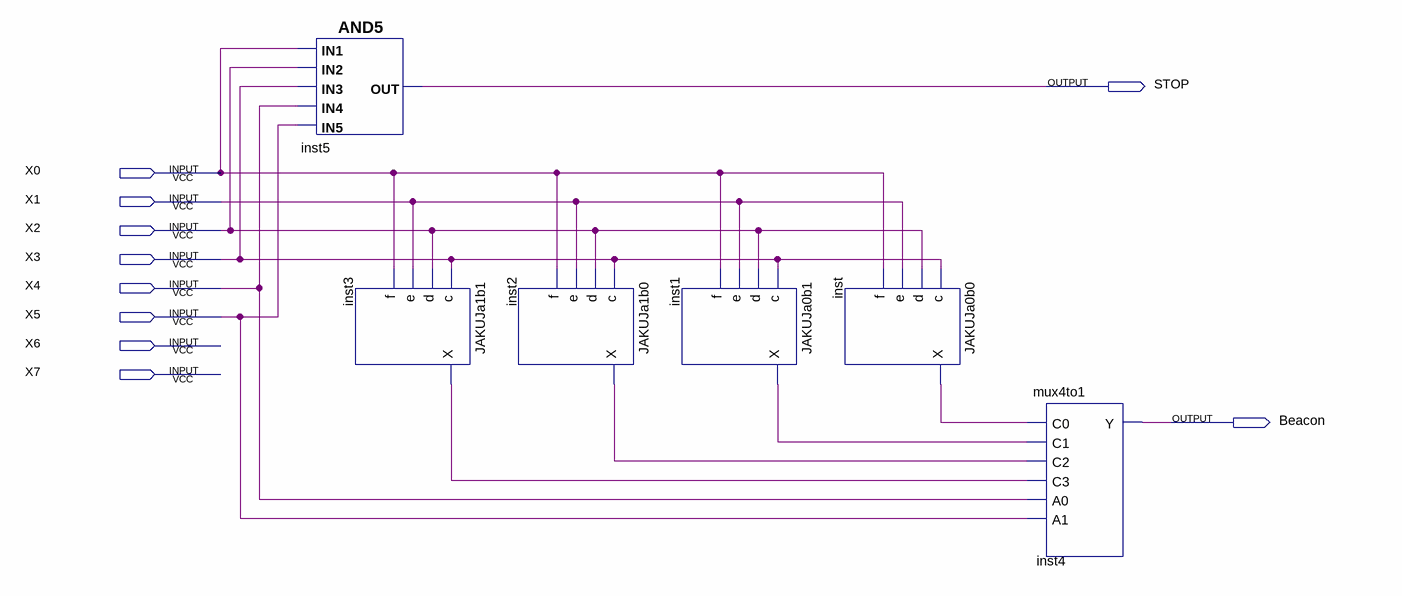
[diagram p0: schematic sheet]
// Quartus schematic MajakJAKUJschematic.bdf as structural Verilog: 6 symbols, 10 pins
module MajakJAKUJschematic (
  input  X0,
  input  X1,
  input  X2,
  input  X3,
  input  X4,
  input  X5,
  input  X6,
  input  X7,
  output STOP,
  output Beacon
);

  wire inst1_x, inst2_x, inst3_x, inst_x;

  and inst5 (STOP, X0, X2, X3, X4, X5);
  JAKUJa1b1 inst3 (.c(X3), .d(X2), .e(X1), .f(X0), .X(inst3_x));
  JAKUJa1b0 inst2 (.c(X3), .d(X2), .e(X1), .f(X0), .X(inst2_x));
  JAKUJa0b1 inst1 (.c(X3), .d(X2), .e(X1), .f(X0), .X(inst1_x));
  JAKUJa0b0 inst (.c(X3), .d(X2), .e(X1), .f(X0), .X(inst_x));
  mux4to1 inst4 (.C0(inst_x), .C1(inst1_x), .C2(inst2_x), .C3(inst3_x), .A0(X4), .A1(X5), .Y(Beacon));
endmodule
